# Altium schematic sheet VCU_Schematic.SchDoc
size A4; DocumentNumber: 3; SheetNumber: 4; SheetTotal: 7
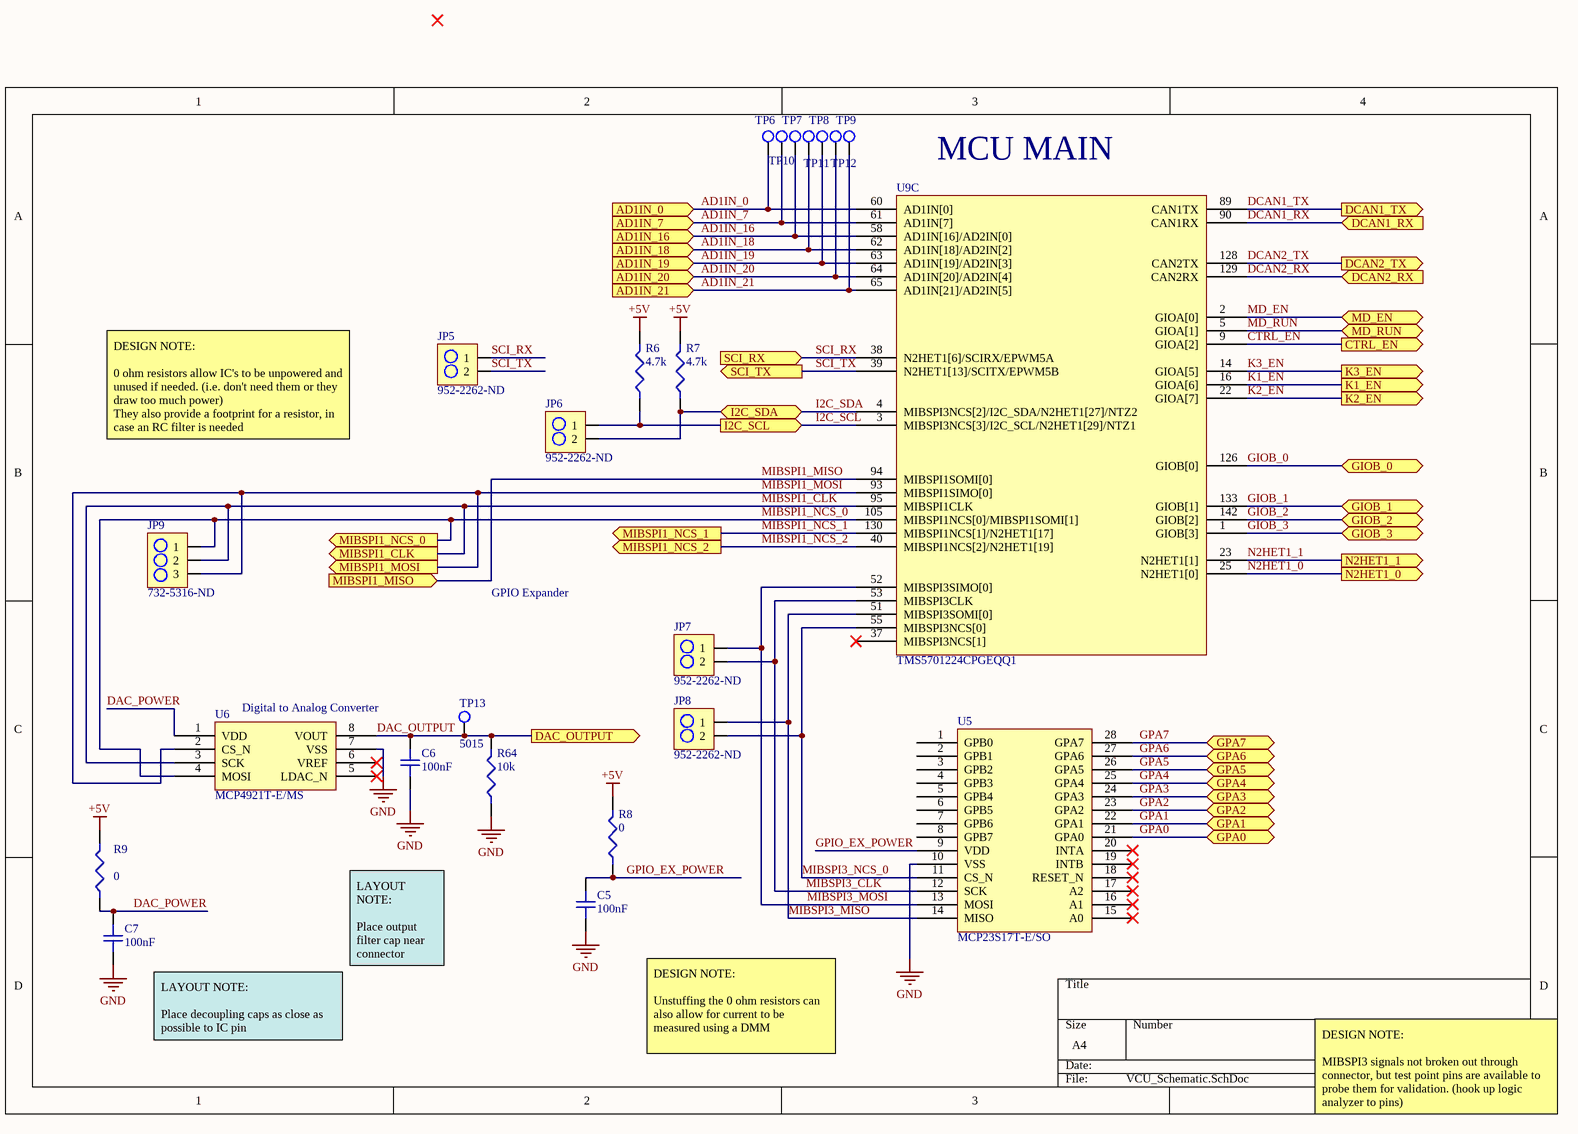
[diagram p0: VCU_Schematic.SchDoc]

## Parts
C5  100nF  [C0805]
C6  100nF  [C0805]
C7  100nF  [C0805]
JP5  952-2262-ND  [2PIN_HEADER]
JP6  952-2262-ND  [2PIN_HEADER]
JP7  952-2262-ND  [2PIN_HEADER]
JP8  952-2262-ND  [2PIN_HEADER]
JP9  732-5316-ND  [3PIN_HEADER]
R6  4.7k  [R0805]
R7  4.7k  [R0805]
R8  0  [R0805]
R9  0  [R0805]
R64  10k  [R0805]
TP6  5015  [TP_HOOK]  (value not drawn)
TP7  5015  [TP_HOOK]  (value not drawn)
TP8  5015  [TP_HOOK]  (value not drawn)
TP9  5015  [TP_HOOK]  (value not drawn)
TP10  5015  [TP_HOOK]  (value not drawn)
TP11  5015  [TP_HOOK]  (value not drawn)
TP12  5015  [TP_HOOK]  (value not drawn)
TP13  5015  [TP_HOOK]
U5  MCP23S17T-E/SO  [28-SOIC_MCP23S17]
U6  MCP4921T-E/MS  [8-MSOP_MCP4921]
U9  TMS5701224CPGEQQ1  [LQFP-144]  (part C of 3)

## Ports
AD1IN_0, AD1IN_7, AD1IN_16, AD1IN_18, AD1IN_19, AD1IN_20, AD1IN_21, CTRL_EN, DAC_OUTPUT, DCAN1_RX, DCAN1_TX, DCAN2_RX, DCAN2_TX, GIOB_0, GIOB_1, GIOB_2, GIOB_3, GPA0, GPA1, GPA2, GPA3, GPA4, GPA5, GPA6, GPA7, I2C_SCL, I2C_SDA, K1_EN, K2_EN, K3_EN, MD_EN, MD_RUN, MIBSPI1_CLK, MIBSPI1_MISO, MIBSPI1_MOSI, MIBSPI1_NCS_0, MIBSPI1_NCS_1, MIBSPI1_NCS_2, N2HET1_0, N2HET1_1, SCI_RX, SCI_TX

## Nets
+5V: R6.2 R7.2 R8.2 R9.2
GND: C5.1 C6.1 C7.1 R64.1 U5.10(VSS) U6.7(VSS)
AD1IN_0: TP6.1 U9.60(AD1IN[0]) ; port AD1IN_0
AD1IN_7: TP10.1 U9.61(AD1IN[7]) ; port AD1IN_7
AD1IN_16: TP7.1 U9.58(AD1IN[16]/AD2IN[0]) ; port AD1IN_16
AD1IN_18: TP11.1 U9.62(AD1IN[18]/AD2IN[2]) ; port AD1IN_18
AD1IN_19: TP8.1 U9.63(AD1IN[19]/AD2IN[3]) ; port AD1IN_19
AD1IN_20: TP12.1 U9.64(AD1IN[20]/AD2IN[4]) ; port AD1IN_20
AD1IN_21: TP9.1 U9.65(AD1IN[21]/AD2IN[5]) ; port AD1IN_21
CTRL_EN: U9.9(GIOA[2]) ; port CTRL_EN
DAC_OUTPUT: C6.2 R64.2 TP13.1 U6.8(VOUT) ; port DAC_OUTPUT
DAC_POWER: C7.2 R9.1 U6.1(VDD)
DCAN1_RX: U9.90(CAN1RX) ; port DCAN1_RX
DCAN1_TX: U9.89(CAN1TX) ; port DCAN1_TX
DCAN2_RX: U9.129(CAN2RX) ; port DCAN2_RX
DCAN2_TX: U9.128(CAN2TX) ; port DCAN2_TX
GIOB_0: U9.126(GIOB[0]) ; port GIOB_0
GIOB_1: U9.133(GIOB[1]) ; port GIOB_1
GIOB_2: U9.142(GIOB[2]) ; port GIOB_2
GIOB_3: U9.1(GIOB[3]) ; port GIOB_3
GPA0: U5.21(GPA0) ; port GPA0
GPA1: U5.22(GPA1) ; port GPA1
GPA2: U5.23(GPA2) ; port GPA2
GPA3: U5.24(GPA3) ; port GPA3
GPA4: U5.25(GPA4) ; port GPA4
GPA5: U5.26(GPA5) ; port GPA5
GPA6: U5.27(GPA6) ; port GPA6
GPA7: U5.28(GPA7) ; port GPA7
GPIO_EX_POWER: C5.2 R8.1 U5.9(VDD)
I2C_SCL: JP6.1 R6.1 U9.3(MIBSPI3NCS[3]/I2C_SCL/N2HET1[29]/NTZ1) ; port I2C_SCL
I2C_SDA: JP6.2 R7.1 U9.4(MIBSPI3NCS[2]/I2C_SDA/N2HET1[27]/NTZ2) ; port I2C_SDA
K1_EN: U9.16(GIOA[6]) ; port K1_EN
K2_EN: U9.22(GIOA[7]) ; port K2_EN
K3_EN: U9.14(GIOA[5]) ; port K3_EN
MD_EN: U9.2(GIOA[0]) ; port MD_EN
MD_RUN: U9.5(GIOA[1]) ; port MD_RUN
MIBSPI1_CLK: JP9.2 U6.3(SCK) U9.95(MIBSPI1CLK) ; port MIBSPI1_CLK
MIBSPI1_MISO: U9.94(MIBSPI1SOMI[0]) ; port MIBSPI1_MISO
MIBSPI1_MOSI: JP9.3 U6.2(CS_N) U9.93(MIBSPI1SIMO[0]) ; port MIBSPI1_MOSI
MIBSPI1_NCS_0: JP9.1 U6.4(MOSI) U9.105(MIBSPI1NCS[0]/MIBSPI1SOMI[1]) ; port MIBSPI1_NCS_0
MIBSPI1_NCS_1: U9.130(MIBSPI1NCS[1]/N2HET1[17]) ; port MIBSPI1_NCS_1
MIBSPI1_NCS_2: U9.40(MIBSPI1NCS[2]/N2HET1[19]) ; port MIBSPI1_NCS_2
MIBSPI3_CLK: JP7.2 U5.12(SCK) U9.53(MIBSPI3CLK)
MIBSPI3_MISO: JP8.1 U5.14(MISO) U9.51(MIBSPI3SOMI[0])
MIBSPI3_MOSI: JP7.1 U5.13(MOSI) U9.52(MIBSPI3SIMO[0])
MIBSPI3_NCS_0: JP8.2 U5.11(CS_N) U9.55(MIBSPI3NCS[0])
N2HET1_0: U9.25(N2HET1[0]) ; port N2HET1_0
N2HET1_1: U9.23(N2HET1[1]) ; port N2HET1_1
SCI_RX: JP5.1 U9.38(N2HET1[6]/SCIRX/EPWM5A) ; port SCI_RX
SCI_TX: JP5.2 U9.39(N2HET1[13]/SCITX/EPWM5B) ; port SCI_TX

Not connected (* = marked no-connect by the designer): U5 1(GPB0) 2(GPB1) 3(GPB2) 4(GPB3) 5(GPB4) 6(GPB5) 7(GPB6) 8(GPB7) 15(A0)* 16(A1)* 17(A2)* 18(RESET_N)* 19(INTB)* 20(INTA)*; U6 5(LDAC_N)* 6(VREF)*; U9 37(MIBSPI3NCS[1])*

## Notes on the sheet
- (near U9) MCU MAIN
- DESIGN NOTE:
  0 ohm resistors allow IC's to be unpowered and unused if needed. (i.e. don't need them or they draw too much power)
  They also provide a footprint for a resistor, in case an RC filter is needed
- GPIO Expander
- Digital to Analog Converter
- LAYOUT NOTE:
  Place output filter cap near connector
- (near C7) LAYOUT NOTE:
  Place decoupling caps as close as possible to IC pin
- DESIGN NOTE:
  Unstuffing the 0 ohm resistors can also allow for current to be measured using a DMM
- DESIGN NOTE:
  MIBSPI3 signals not broken out through connector, but test point pins are available to probe them for validation. (hook up logic analyzer to pins)

## Library data of the parts
C5-C7 = GRM21B7U1A104JA01L: CAP MLCC 100nF 10Volts U2J 5%; Manufacturer: Murata; Voltage Rating: 10V; Supplier 1: Digi-Key; Manufacturer Part Number: GRM21B7U1A104JA01L; Stock 1: 6000; Pricing 1: 1=0.46, 10=0.32, 100=0.192, 500=0.144, 1000=0.1216 (USD); Mount: Surface Mount; Case/Package: 0805; Case Code (Imperial): 0805; Case Code (Metric): 2012; Min Operating Temperature: -55°C; Max Operating Temperature: 125°C; Capacitance: 100nF; Voltage Rating (DC): 10V; Tolerance: 5%; Packaging: Tape and Reel; Package Quantity: 3000; Dielectric: U2J; Termination: SMD/SMT; Length: 2mm; Height: 1.25mm; Width: 0.049inch; Thickness: 0.053inch; Depth: 1.25mm; Radiation Hardening: No; ComponentLink1URL: https://datasheet.ciiva.com/5424/product-5424660.pdf; ComponentLink1Description: https://datasheet.ciiva.com/5424/product-5424660.pdf; ComponentLink2URL: https://datasheet.ciiva.com/17451/product-17451845.pdf; ComponentLink2Description: https://datasheet.ciiva.com/17451/product-17451845.pdf; ComponentLink3URL: https://datasheet.ciiva.com/11618/product-11618924.pdf; ComponentLink3Description: https://datasheet.ciiva.com/11618/product-11618924.pdf; Supplier Part Number 1: 490-11592-6-ND
JP5-JP8 = M20-9990246: CONN_HeaderPins2pos Headers & Wire Housings 02 SIL VERTICAL PIN HEADER TIN; Manufacturer: Harwin; Contact Resistance: 30mR; Max Current Rating: 3A; Number of Positions: 2; Gender: Male; Connector Type: Male Pin; Insulation Resistance: 10GR; Voltage Rating (AC): 750V; Pitch: 2.54mm; Supplier 1: Digi-Key; Manufacturer Part Number: M20-9990246; Stock 1: 53577; Pricing 1: 1=0.11, 10=0.099, 100=0.0609, 500=0.0504, 1000=0.0441, 5000=0.0378, 10000=0.0368 (USD); Case/Package: SIL; Colour: Black; Housing Colour: Black; Housing Material: Nylon; Contact Plating: Tin; Contact Material: Bronze,Brass; Min Operating Temperature: -40°C; Max Operating Temperature: 105°C; Package Quantity: 1000; Packaging: Bulk; Termination: Solder; Number of Rows: 1; Number of Contacts: 2; Orientation: Straight; Current Rating: 3A; Length: 5.08mm; Depth: 2.54mm; Contact Mating Length: 0.24inch; Radiation Hardening: No; REACH SVHC: No SVHC; ComponentLink1URL: https://datasheet.ciiva.com/8046/315376-8046930.pdf; ComponentLink1Description: https://datasheet.ciiva.com/8046/315376-8046930.pdf; ComponentLink2URL: https://datasheet.ciiva.com/6833/m20-999-6833368.pdf; ComponentLink2Description: https://datasheet.ciiva.com/6833/m20-999-6833368.pdf; ComponentLink3URL: https://datasheet.ciiva.com/11745/0900766b81034e61-11745755.pdf; ComponentLink3Description: https://datasheet.ciiva.com/11745/0900766b81034e61-11745755.pdf; ComponentLink4URL: https://datasheet.ciiva.com/22660/1830818-22660571.pdf; ComponentLink4Description: https://datasheet.ciiva.com/22660/1830818-22660571.pdf; ComponentLink5URL: https://datasheet.ciiva.com/26852/getdatasheetpartid-384170-26852203.pdf; ComponentLink5Description: https://datasheet.ciiva.com/26852/getdatasheetpartid-384170-26852203.pdf; Supplier Part Number 1: 952-2262-ND
JP9 = 61300311121: CONN_HeaderPins3pos WURTH ELEKTRONIK Board-To-Board Connector, Vertical, WR-PHD Series, Through Hole, Header, 3 Contacts, 2.54 mm; Manufacturer: Wurth Electronics; Number of Positions: 3; Gender: Male; Connector Type: Male Pin; Pitch: 0.1inch; Supplier 1: Digi-Key; Manufacturer Part Number: 61300311121; Stock 1: 57026; Pricing 1: 1=0.13, 10=0.106, 25=0.088, 50=0.074, 100=0.067, 1000=0.061 (USD); Mount: Through Hole; Case/Package: 100; Contact Plating: Gold; Contact Material: Copper; Colour: Black; Number of Rows: 1; Packaging: Bulk; Termination: Solder; Number of Contacts: 3; Contact Mating Length: 0.236inch; REACH SVHC: Unknown; Lead Free: Lead Free; ComponentLink1URL: http://www.farnell.com/cad/1737268.pdf; ComponentLink1Description: http://www.farnell.com/cad/1737268.pdf; Supplier Part Number 1: 732-5316-ND
R6 R7 = RC0805FR-074K7L: RES SMD 4.7K OHM 1% 1/8W 0805; Manufacturer: Yageo; Resistance: 4.7KR; Temperature Coefficient: 100ppm/°C; Power Rating: 125mW; Voltage Rating: 150V; Supplier 1: Digi-Key; Manufacturer Part Number: RC0805FR-074K7L; Stock 1: 2632902; Pricing 1: 1=0.1, 10=0.022, 100=0.0088, 1000=0.004, 2500=0.0034 (USD); Case/Package: 0805; Number of Pins: 2; Case Code (Metric): 2012; Case Code (Imperial): 0805; Min Operating Temperature: -55°C; Max Operating Temperature: 155°C; Packaging: Tape and Reel; Tolerance: 1%; Composition: Thick Film; Voltage Rating (DC): 150V; Termination: SMD/SMT; Military Standard: Not; Package Quantity: 5000; Number of Terminations: 2; Max Power Dissipation: 125mW; Length: 0.079inch; Height: 0.024inch; Width: 0.049inch; Depth: 1.25mm; REACH SVHC: No SVHC; Lead Free: Lead Free; ComponentLink1URL: https://datasheet.ciiva.com/11808/0900766b8106beab-11808155.pdf; ComponentLink1Description: https://datasheet.ciiva.com/11808/0900766b8106beab-11808155.pdf; ComponentLink2URL: https://datasheet.ciiva.com/7941/444164-7941804.pdf; ComponentLink2Description: https://datasheet.ciiva.com/7941/444164-7941804.pdf; ComponentLink3URL: https://datasheet.ciiva.com/7941/1686128-7941805.pdf; ComponentLink3Description: https://datasheet.ciiva.com/7941/1686128-7941805.pdf; ComponentLink4URL: https://datasheet.ciiva.com/7941/444164-7941806.pdf; ComponentLink4Description: https://datasheet.ciiva.com/7941/444164-7941806.pdf; ComponentLink5URL: https://datasheet.ciiva.com/6547/pyu-r-int-thick-7-6547263.pdf; ComponentLink5Description: https://datasheet.ciiva.com/6547/pyu-r-int-thick-7-6547263.pdf; ComponentLink6URL: https://datasheet.ciiva.com/46447/444164-46447583.pdf; ComponentLink6Description: https://datasheet.ciiva.com/46447/444164-46447583.pdf; Supplier Part Number 1: 311-4.70KCRDKR-ND
R8 R9 = RC0805JR-070RL: RES SMD 0 OHM 1/8W 0805; Manufacturer: Yageo; Resistance: 0mR; Tolerance: 5%; Voltage Rating: 150V; Power Rating: 125mW; Temperature Coefficient: 200ppm/°C; Supplier 1: Digi-Key; Manufacturer Part Number: RC0805JR-070RL; Stock 1: 5922085; Pricing 1: 1=0.1, 10=0.018, 25=0.0128, 50=0.0096, 100=0.0071, 250=0.0054, 500=0.0044, 1000=0.0032 (USD); Case/Package: 0805; Number of Pins: 2; Case Code (Imperial): 0805; Case Code (Metric): 2012; Contact Plating: Tin,Matte; Min Operating Temperature: -55°C; Max Operating Temperature: 155°C; Packaging: Tape and Reel; Voltage Rating (DC): 150V; Termination: SMD/SMT; Composition: Thick Film; Military Standard: Not; Length: 2mm; Height: 0.5mm; Width: 1.25mm; Depth: 1.25mm; Radiation Hardening: No; REACH SVHC: Unknown; Lead Free: Lead Free; ComponentLink1URL: https://datasheet.ciiva.com/7941/1738694-7941861.pdf; ComponentLink1Description: https://datasheet.ciiva.com/7941/1738694-7941861.pdf; ComponentLink2URL: https://datasheet.ciiva.com/7941/1738694-7941862.pdf; ComponentLink2Description: https://datasheet.ciiva.com/7941/1738694-7941862.pdf; ComponentLink3URL: https://datasheet.ciiva.com/11819/0900766b8106beab-11819430.pdf; ComponentLink3Description: https://datasheet.ciiva.com/11819/0900766b8106beab-11819430.pdf; ComponentLink4URL: https://datasheet.ciiva.com/7941/1738694-7941863.pdf; ComponentLink4Description: https://datasheet.ciiva.com/7941/1738694-7941863.pdf; ComponentLink5URL: https://datasheet.ciiva.com/15190/getdatasheetpartid-330685-15190028.pdf; ComponentLink5Description: https://datasheet.ciiva.com/15190/getdatasheetpartid-330685-15190028.pdf; Supplier Part Number 1: 311-0.0ARDKR-ND
R64 = RC0805FR-071KL: RES SMD 10K OHM 1% 1/8W 0805; Manufacturer: Yageo Phycomp; Temperature Coefficient: 100ppm/°C; Resistance: 1KR; Voltage Rating (DC): 150V; Power Rating: 125mW; Supplier 1: Digi-Key; Manufacturer Part Number: RC0805FR-071KL; Stock 1: 5527973; Pricing 1: 1=0.1, 10=0.022, 100=0.0088, 1000=0.004, 2500=0.0034 (USD); Case/Package: 0805; Number of Pins: 2; Min Operating Temperature: -55°C; Max Operating Temperature: 155°C; Tolerance: 1%; Packaging: Cut Tape; Length: 2mm; Height: 0.5mm; Width: 1.25mm; Depth: 1.25mm; REACH SVHC: No SVHC; Lead Free: Lead Free
TP6-TP13 = 5015: TEST POINT, PCB, SMT; Manufacturer: Keystone Electronics; Number of Ports: 1; Supplier 1: Digi-Key; Manufacturer Part Number: 5015; Stock 1: 1937775; Pricing 1: 1=0.44, 10=0.421, 25=0.3604, 50=0.3064, 100=0.2944, 250=0.2644, 500=0.2524 (USD); Mount: Surface Mount; Colour: White; Contact Material: Bronze; Contact Plating: Tin,Silver,Lead; Material: Bronze,Silver; Package Quantity: 1; Packaging: Tape and Reel; Termination: Solder; Orientation: Straight; Length: 2.66mm; Height: 0.06inch; Thickness: 0.01inch; Depth: 1.01mm; REACH SVHC: No SVHC; Lead Free: Lead Free; ComponentLink1URL: https://datasheet.ciiva.com/2917/5015-2917616.pdf; ComponentLink1Description: https://datasheet.ciiva.com/2917/5015-2917616.pdf; ComponentLink2URL: https://datasheet.ciiva.com/2917/5015-2917617.pdf; ComponentLink2Description: https://datasheet.ciiva.com/2917/5015-2917617.pdf; ComponentLink3URL: https://datasheet.ciiva.com/1123/5015-1123862.pdf; ComponentLink3Description: https://datasheet.ciiva.com/1123/5015-1123862.pdf; ComponentLink4URL: https://datasheet.ciiva.com/16883/70182998-16883734.pdf; ComponentLink4Description: https://datasheet.ciiva.com/16883/70182998-16883734.pdf; Supplier Part Number 1: 36-5015CT-ND
U5 = MCP23S17T-E/SO: IC I/O Expander, 16bit, 10 MHz, SPI, 4.5 V, 5.5 V, SOIC; Manufacturer: Microchip; Interface: SPI,Serial; Min Supply Voltage: 4.5V; Max Supply Voltage: 5.5V; Number of Channels: 1; Nominal Supply Current: 1mA; Number of I/Os: 16; Power Dissipation: 700mW; Frequency: 10MHz; Supplier 1: Digi-Key; Manufacturer Part Number: MCP23S17T-E/SO; Stock 1: 6929; Pricing 1: 1=1.32, 25=1.1024, 100=0.9975 (USD); Mount: Surface Mount; Case/Package: SOIC; Number of Pins: 28; Min Operating Temperature: -40°C; Max Operating Temperature: 125°C; Packaging: Tape and Reel; Package Quantity: 1600; Max Frequency: 10MHz; Number of Bits: 16; REACH SVHC: No SVHC; Lead Free: Lead Free; ComponentLink1URL: https://datasheet.ciiva.com/1780/21952b-1780739.pdf; ComponentLink1Description: https://datasheet.ciiva.com/1780/21952b-1780739.pdf; ComponentLink2URL: https://datasheet.ciiva.com/1495/12179-1495927.pdf; ComponentLink2Description: https://datasheet.ciiva.com/1495/12179-1495927.pdf; ComponentLink3URL: https://datasheet.ciiva.com/16221/filehandler-aspxddocname-en023709-16221082.pdf; ComponentLink3Description: https://datasheet.ciiva.com/16221/filehandler-aspxddocname-en023709-16221082.pdf; ComponentLink4URL: https://datasheet.ciiva.com/16617/21952b-16617644.pdf; ComponentLink4Description: https://datasheet.ciiva.com/16617/21952b-16617644.pdf; ComponentLink5URL: https://datasheet.ciiva.com/1505/21952b-1505037.pdf; ComponentLink5Description: https://datasheet.ciiva.com/1505/21952b-1505037.pdf; ComponentLink6URL: https://datasheet.ciiva.com/12266/21952b-12266927.pdf; ComponentLink6Description: https://datasheet.ciiva.com/12266/21952b-12266927.pdf; Supplier Part Number 1: MCP23S17T-E/SODKR-ND
U6 = MCP4921T-E/MS: IC Digital to Analog Converters - DAC Sgl 12-bit SPI int; Manufacturer: Microchip; Interface: SPI,Serial; Number of DAC Channels: 1; Supply Voltage: 5V; Min Supply Voltage: 2.7V; Max Supply Voltage: 5.5V; Settling Time: 4.5us; Number of Bits: 12; Resolution: 12b; Supply Type: Single; Integral Nonlinearity (INL): 12LSB; Input Offset Voltage (Vos): 820uV; Nominal Supply Current: 175uA; Supplier 1: Digi-Key; Manufacturer Part Number: MCP4921T-E/MS; Stock 1: 5999; Pricing 1: 1=2.07, 25=1.722, 100=1.5645 (USD); Mount: Surface Mount; Case/Package: MSOP; Number of Pins: 8; Min Operating Temperature: -40°C; Max Operating Temperature: 125°C; Packaging: Tape and Reel; Number of Channels: 1; Package Quantity: 1; Number of Converters: 1; Radiation Hardening: No; REACH SVHC: No SVHC; Lead Free: Lead Free; ComponentLink1URL: https://datasheet.ciiva.com/3041/22248a-3041510.pdf; ComponentLink1Description: https://datasheet.ciiva.com/3041/22248a-3041510.pdf; ComponentLink2URL: https://datasheet.ciiva.com/6666/22248a-6666553.pdf; ComponentLink2Description: https://datasheet.ciiva.com/6666/22248a-6666553.pdf; ComponentLink3URL: https://datasheet.ciiva.com/8035/22248a-8035052.pdf; ComponentLink3Description: https://datasheet.ciiva.com/8035/22248a-8035052.pdf; ComponentLink4URL: https://datasheet.ciiva.com/16625/22248a-16625692.pdf; ComponentLink4Description: https://datasheet.ciiva.com/16625/22248a-16625692.pdf; ComponentLink5URL: https://datasheet.ciiva.com/16203/filehandler-aspxddocname-en547911-16203277.pdf; ComponentLink5Description: https://datasheet.ciiva.com/16203/filehandler-aspxddocname-en547911-16203277.pdf; ComponentLink6URL: https://datasheet.ciiva.com/6666/22248a-6666558.pdf; ComponentLink6Description: https://datasheet.ciiva.com/6666/22248a-6666558.pdf; ComponentLink7URL: https://datasheet.ciiva.com/41459/001083287-da-01-en-ic-dac-12-w-spi-mcp4921t-e-ms-msop-8-mcp-41459046.pdf; ComponentLink7Description: https://datasheet.ciiva.com/41459/001083287-da-01-en-ic-dac-12-w-spi-mcp4921t-e-ms-msop-8-mcp-41459046.pdf; Supplier Part Number 1: MCP4921T-E/MSCT-ND
U9 = TMS5701224CPGEQQ1: ARM CORTEX R4 LOCK STEP HERCULES MCU; Manufacturer: Texas Instruments; Frequency: 160MHz; Interface: I2C,SPI,CAN,UART,USART,LIN,SCI,EBI/EMI; Number of I/Os: 64; Oscillator Type: External; RAM Size: 192KB; Number of Timers/Counters: 2; Watchdog Timer: Yes; Memory Type: FLASH; Memory Size: 1.25MB; Density: 1310720B; Peripherals: POR,PWM,WDT,DMA; Supplier 1: Digi-Key; Manufacturer Part Number: TMS5701224CPGEQQ1; Stock 1: 113; Pricing 1: 1=22.12, 10=20.402, 100=17.4222, 500=15.8176 (USD); Case/Package: LQFP; Number of Pins: 144; Min Operating Temperature: -40°C; Max Operating Temperature: 125°C; Packaging: Tray; Number of Programmable I/O: 64; Max Frequency: 160MHz; Number of GPIO: 64; Core Architecture: ARM; Lead Free: Lead Free; ComponentLink1URL: http://www.ti.com/lit/pdf/spnu515; ComponentLink1Description: http://www.ti.com/lit/pdf/spnu515; ComponentLink2URL: http://www.ti.com/lit/gpn/tms570ls1224; ComponentLink2Description: http://www.ti.com/lit/gpn/tms570ls1224; ComponentLink3URL: http://www.ti.com/general/docs/lit/getliterature.tsp?genericPartNumber=TMS570LS1224&&fileType=pdf; ComponentLink3Description: http://www.ti.com/general/docs/lit/getliterature.tsp?genericPartNumber=TMS570LS1224&&fileType=pdf; Supplier Part Number 1: 296-47200-ND